# EAGLE design TConn2 (EAGLE 9.1.3)
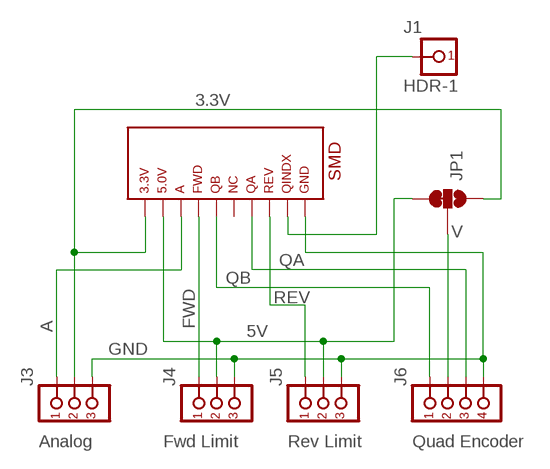
[diagram p0: schematic, sheet 1]

## Parts
J1  HDR-1  [POST1X1]
J3  HDR-3  [POST1X3]
J4  HDR-3NYLON-RT-3  [NYLON-RT-3]
J5  HDR-3NYLON-RT-3  [NYLON-RT-3]
J6  HDR-4NYLON-RT-4  [NYLON-RT-4]
JP1  JUMPER-SMT_3_1-NC_TRACE_SILK  [SMT-JUMPER_3_1-NC_TRACE_SILK]
T1  TANON-HDR-THSMD-MOUNT  [TALON-5X2-SMD2]

## Nets
3.3V: J3.2 JP1.1 T1.P$1
5V: J4.P$2 J5.P$2 JP1.3 T1.P$2
A: J3.1 T1.P$3
FWD: J4.P$1 T1.P$4
GND: J3.3 J4.P$3 J5.P$3 J6.P$4 T1.P$10
N$1: J1.1 T1.P$9
QA: J6.P$3 T1.P$7
QB: J6.P$1 T1.P$5
REV: J5.P$1 T1.P$8
V: J6.P$2 JP1.2
Unconnected: T1.P$6

## Notes on the sheet
- SMD
- Analog | Fwd Limit | Rev Limit | Quad Encoder

## Library data of the parts
J1 = Team4415:HDR-1
J3-J5 = Team4415:HDR-3
J6 = Team4415:HDR-4
JP1 = SparkFun-Jumpers:JUMPER-SMT_3_1-NC_TRACE: Normally closed trace jumper (1 of 2 connections) This jumper has a trace between two pads so it's normally closed (NC). The other connection is normally open (NO). Use a razor knife to open the connection. For best results follow the IPC guidelines for cutting traces: Cutout at least 0.063 mm (0.005 in). Remove all loose material to clean up the cut area. Seal the cut with an approved epoxy. Reapply solder to reclose the connection, or to close the NO connection.
T1 = Team4415:TANON-HDR-TH

## Board
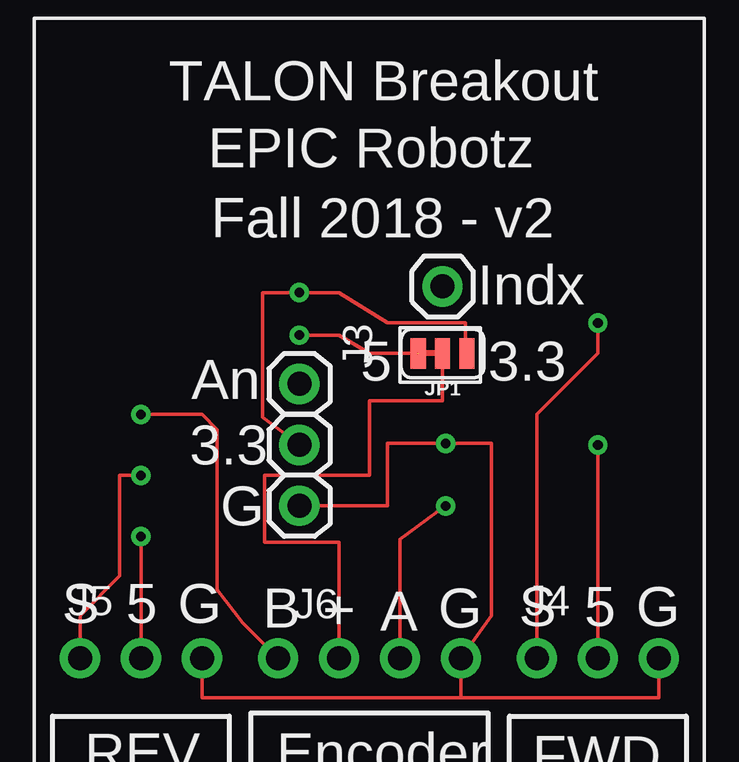
[diagram p1: board, top side]
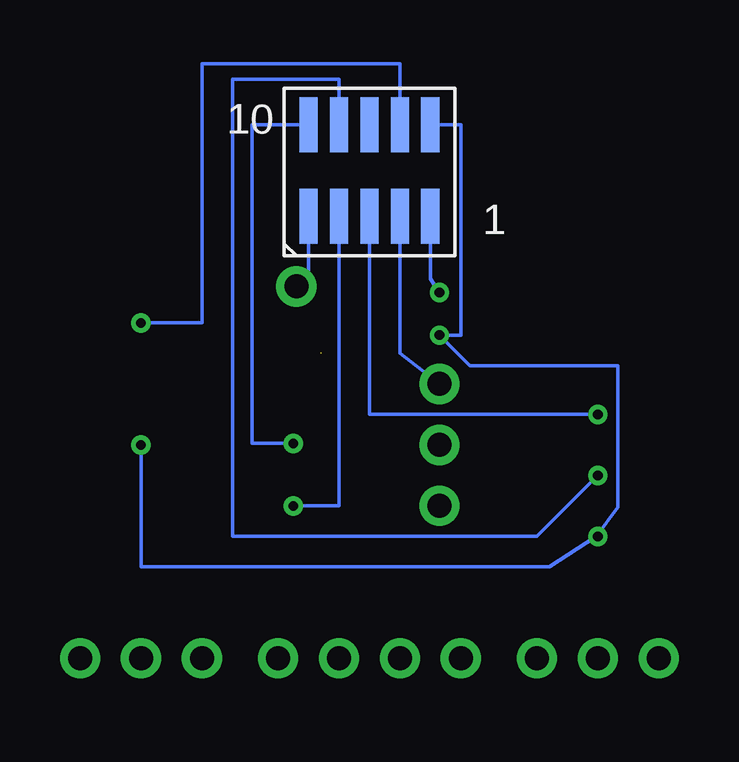
[diagram p2: board, bottom side, seen from below]

No outline drawn. Coordinates in mm, seen from the top.
Copper layers (1*16): Top 0.035mm / dielectric 1.5mm / Bottom 0.035mm
Design rules "default": minimum track width 6mil, minimum drill 0.35mm, track to track 6mil, track to pad 6mil, pad to pad 6mil, via to via 6mil, smd to smd 6mil, copper to edge 40mil, drill to drill 6mil, minimum pad ring 10mil, minimum via ring 8mil, stop-mask expansion 4mil, vias tented up to drill 0mil, thermal gap 10mil

### Footprints (pad centres in the part's own frame; a part is rotated, then mirrored left to right if it is on the bottom)
POST1X1 = drill 1 pad 1.676: 1 0,0
POST1X3 = drill 1 pad 1.676: 1 0,0; 2 2.54,0; 3 5.08,0
NYLON-RT-3 = drill 1 pad 1.676: P$1 0,0; P$2 2.54,0; P$3 5.08,0
NYLON-RT-4 = drill 1 pad 1.676: P$1 0,0; P$2 2.54,0; P$3 5.08,0; P$4 7.62,0
SMT-JUMPER_3_1-NC_TRACE_SILK = smd 0.635 x 1.27: 1 -1.016,0; 2 0,0; 3 1.016,0
TALON-5X2-SMD2 = smd 0.762 x 2.286: P$1 2.54,-1.905; P$2 2.54,1.905; P$3 1.27,-1.905; P$4 1.27,1.905; P$5 0,-1.905; P$6 0,1.905; P$7 -1.27,-1.905; P$8 -1.27,1.905; P$9 -2.54,-1.905; P$10 -2.54,1.905

### Placement (x,y rotation side)
J1  17.02,23.11 0 top
J3  11.05,19.05 270 top
J4  20.95,7.62 0 top
J5  1.91,7.62 0 top
J6  10.16,7.62 0 top
JP1  17.02,20.32 180 top
T1  13.97,27.94 0 bottom

### Tracks (layer width: path | path; a pad name or v marks a point on that pad's centre or on a via)
3.3V  (via drill 0.4)
  Top 0.152: J3.2 9.53,17.65 9.53,22.86 v11.05,22.86 12.7,22.86 14.73,21.59 17.97,21.59 17.97,20.38 JP1.1
  Bottom 0.152: v11.05,22.86 11.43,23.43 T1.P$1
5V  (via drill 0.4)  (1 unrouted)
  Top 0.152: v11.05,21.08 12.7,21.08 13.97,20.32 15.96,20.32 | J5.P$2 v4.45,12.7 | v23.5,16.51 J4.P$2
  Bottom 0.152: T1.P$2 10.16,29.84 10.16,21.08 v11.05,21.08 9.78,19.81 3.62,19.81 3.62,13.91 4.51,12.7 | v23.5,16.51 23.5,11.43 6.48,11.43 4.51,12.7 | 4.51,12.7 v4.45,12.7
A
  Bottom 0.152: T1.P$3 12.7,20.32 J3.1
FWD  (via drill 0.4)
  Top 0.152: v23.5,21.59 23.5,20.32 20.95,17.78 J4.P$1
  Bottom 0.152: T1.P$4 12.7,32.4 16.45,32.4 20.95,32.4 20.95,21.59 v23.5,21.59
GND  (via drill 0.4)
  Top 0.152: J5.P$3 6.99,5.97 16.89,5.97 17.78,5.97 | 17.78,5.97 J6.P$4 19.05,9.4 19.05,16.57 v17.14,16.57 14.73,16.57 14.73,13.97 J3.3 | J4.P$3 26.04,5.97 17.78,5.97
  Bottom 0.152: T1.P$10 18.86,29.84 18.86,16.57 v17.14,16.57
N$1
  Bottom 0.152: T1.P$9 16.51,23.62 J1.1
QA  (via drill 0.4)
  Top 0.152: v17.14,13.97 15.24,12.57 J6.P$3
  Bottom 0.152: T1.P$7 15.24,13.97 v17.14,13.97
QB  (via drill 0.4)
  Top 0.152: J6.P$1 8.68,9.1 7.62,10.48 7.62,17.14 6.99,17.78 v4.45,17.78
  Bottom 0.152: T1.P$5 13.97,25.91 | 13.97,25.91 13.97,25.53 | v4.45,17.78 13.97,17.78 13.97,25.91
REV  (via drill 0.4)
  Top 0.152: v4.45,15.24 3.56,15.24 3.56,11.05 1.91,9.4 J5.P$1
  Bottom 0.152: T1.P$8 15.24,31.75 19.05,31.75 19.68,31.75 19.68,12.7 6.99,12.7 v4.45,15.24
V
  Top 0.152: J6.P$2 12.7,12.46 9.6,12.45 9.6,15.24 13.97,15.24 13.97,18.35 17.02,18.35 JP1.2

### Text on the board
tSilk: TALON Breakout | EPIC Robotz | Fall 2018 - v2 | Indx | 5 | 3.3 | An | 3.3 | G | S | 5 | G | B | + | A | G | S | 5 | G | REV | Encoder | FWD